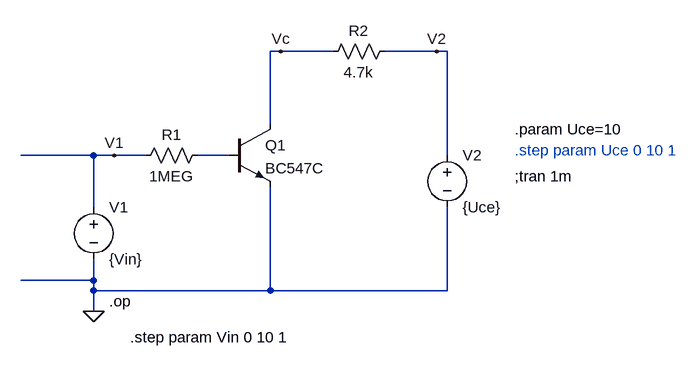
[diagram p0: schematic 4_Ic-Ib-characteristics.asc]
4_Ic-Ib-characteristics.asc, the LTspice schematic file:
Version 4
SHEET 1 1180 680
WIRE 480 -112 464 -112
WIRE 560 -112 480 -112
WIRE 720 -112 640 -112
WIRE 736 -112 720 -112
WIRE 464 0 464 -112
WIRE 192 48 80 48
WIRE 224 48 192 48
WIRE 272 48 224 48
WIRE 400 48 352 48
WIRE 736 48 736 -112
WIRE 192 128 192 48
WIRE 192 240 192 208
WIRE 192 240 80 240
WIRE 192 256 192 240
WIRE 464 256 464 96
WIRE 464 256 192 256
WIRE 736 256 736 128
WIRE 736 256 464 256
WIRE 192 288 192 256
FLAG 192 288 0
FLAG 224 48 V1
FLAG 720 -112 V2
FLAG 480 -112 Vc
SYMBOL npn3 400 0 R0
SYMATTR InstName Q1
SYMATTR Value BC547C
SYMBOL res 368 32 R90
WINDOW 0 0 56 VBottom 2
WINDOW 3 32 56 VTop 2
SYMATTR InstName R1
SYMATTR Value 1MEG
SYMBOL res 656 -128 R90
WINDOW 0 0 56 VBottom 2
WINDOW 3 32 56 VTop 2
SYMATTR InstName R2
SYMATTR Value 4.7k
SYMBOL voltage 736 32 R0
WINDOW 123 0 0 Left 2
WINDOW 39 0 0 Left 2
SYMATTR InstName V2
SYMATTR Value {Uce}
SYMBOL voltage 192 112 R0
WINDOW 123 0 0 Left 2
WINDOW 39 0 0 Left 2
SYMATTR InstName V1
SYMATTR Value {Vin}
TEXT 216 272 Left 2 !.op
TEXT 840 40 Left 2 ;.step param Uce 0 10 1
TEXT 840 80 Left 2 !;tran 1m
TEXT 840 8 Left 2 !.param Uce=10
TEXT 248 328 Left 2 !.step param Vin 0 10 1

The netlist it stands for:
* 4_Ic-Ib-characteristics.asc
Q1 Vc N001 0 0 BC547C
R1 N001 V1 1MEG
R2 V2 Vc 4.7k
V2 V2 0 {Uce}
V1 V1 0 {Vin}
.model NPN NPN
.model PNP PNP
.lib standard.bjt
.op
* .step param Uce 0 10 1
;tran 1m
.param Uce=10
.step param Vin 0 10 1
.backanno
.end